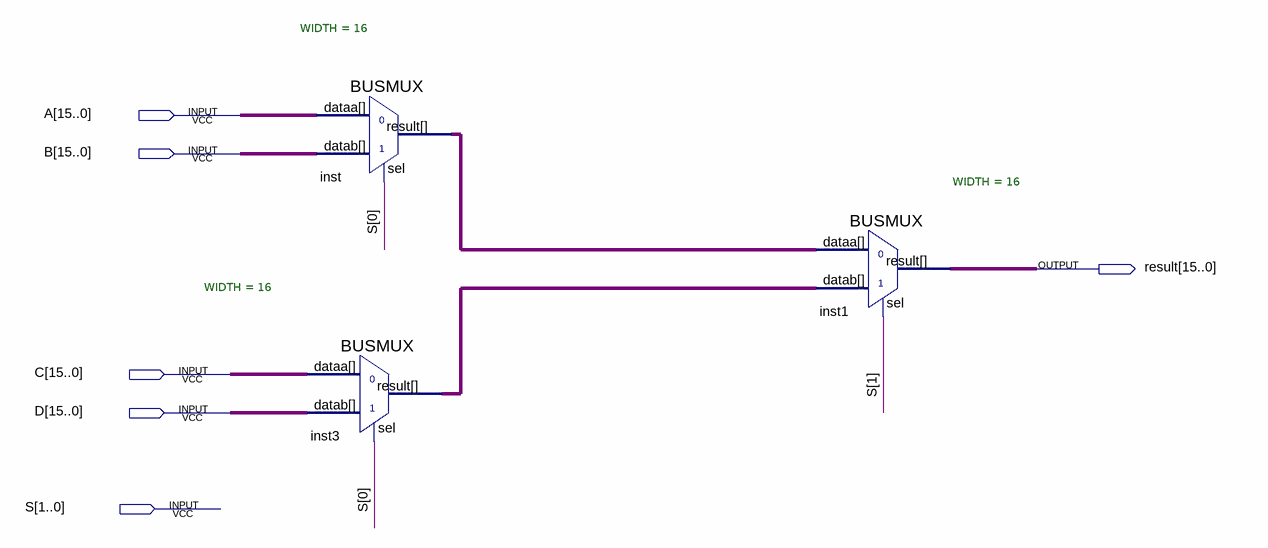
[diagram p0: schematic sheet]
// Quartus schematic mux4-1_16bit.bdf as structural Verilog: 3 symbols, 6 pins
module \mux4-1_16bit  (
  input  [15:0] A,
  input  [15:0] B,
  input  [15:0] C,
  input  [15:0] D,
  input  [1:0] S,
  output [15:0] result
);

  wire [15:0] inst3_result, inst_result;

  BUSMUX #(.WIDTH(16)) inst (.datab(B), .sel(S[0]), .dataa(A), .result(inst_result));
  BUSMUX #(.WIDTH(16)) inst3 (.datab(D), .sel(S[0]), .dataa(C), .result(inst3_result));
  BUSMUX #(.WIDTH(16)) inst1 (.datab(inst3_result), .sel(S[1]), .dataa(inst_result), .result(result));
endmodule
